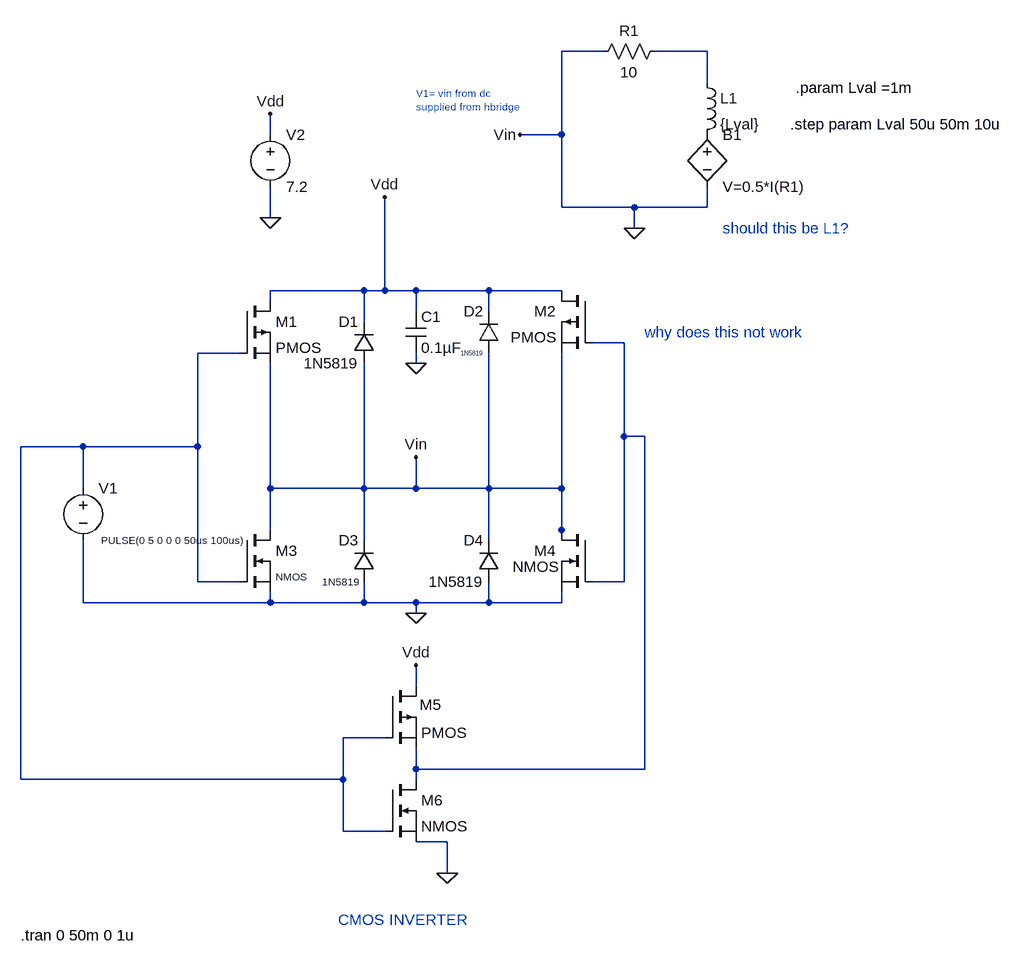
[diagram p0: schematic rl series_SMT WRONG.asc]
rl series_SMT WRONG.asc, the LTspice schematic file:
Version 4.1
SHEET 1 880 1528
WIRE 128 144 64 144
WIRE 288 144 208 144
WIRE 288 192 288 144
WIRE -384 272 -384 240
WIRE 64 272 64 144
WIRE 64 272 0 272
WIRE 64 384 64 272
WIRE 176 384 64 384
WIRE 288 384 288 352
WIRE 288 384 176 384
WIRE -384 400 -384 352
WIRE 176 416 176 384
WIRE -240 512 -384 512
WIRE -208 512 -208 368
WIRE -208 512 -240 512
WIRE -160 512 -208 512
WIRE -48 512 -160 512
WIRE 64 512 -48 512
WIRE -384 528 -384 512
WIRE -160 544 -160 512
WIRE -48 544 -48 512
WIRE -240 560 -240 512
WIRE 160 592 112 592
WIRE -432 608 -496 608
WIRE -160 624 -160 608
WIRE 160 736 160 592
WIRE 192 736 160 736
WIRE -672 752 -768 752
WIRE -496 752 -496 608
WIRE -496 752 -672 752
WIRE -672 816 -672 752
WIRE -384 816 -384 624
WIRE -240 816 -240 624
WIRE -240 816 -384 816
WIRE -160 816 -160 768
WIRE -160 816 -240 816
WIRE -48 816 -48 608
WIRE -48 816 -160 816
WIRE 64 816 64 608
WIRE 64 816 -48 816
WIRE -384 880 -384 816
WIRE 64 880 64 816
WIRE -240 896 -240 816
WIRE -48 896 -48 816
WIRE 64 896 64 880
WIRE -496 960 -496 752
WIRE -432 960 -496 960
WIRE 160 960 160 736
WIRE 160 960 112 960
WIRE -672 992 -672 896
WIRE -384 992 -384 976
WIRE -384 992 -672 992
WIRE -240 992 -240 960
WIRE -240 992 -384 992
WIRE -160 992 -240 992
WIRE -48 992 -48 960
WIRE -48 992 -160 992
WIRE 64 992 64 976
WIRE 64 992 -48 992
WIRE -160 1008 -160 992
WIRE -160 1120 -160 1088
WIRE -208 1200 -272 1200
WIRE -160 1248 -160 1216
WIRE 192 1248 192 736
WIRE 192 1248 -160 1248
WIRE -768 1264 -768 752
WIRE -272 1264 -272 1200
WIRE -272 1264 -768 1264
WIRE -160 1264 -160 1248
WIRE -272 1344 -272 1264
WIRE -208 1344 -272 1344
WIRE -112 1360 -160 1360
WIRE -112 1408 -112 1360
FLAG 176 416 0
FLAG 0 272 Vin
FLAG -208 368 Vdd
FLAG -160 1008 0
FLAG -384 240 Vdd
FLAG -384 400 0
FLAG -160 768 Vin
FLAG -160 1088 Vdd
FLAG -112 1408 0
FLAG -160 624 0
SYMBOL res 224 128 R90
WINDOW 0 0 56 VBottom 2
WINDOW 3 32 56 VTop 2
SYMATTR InstName R1
SYMATTR Value 10
SYMBOL ind 272 176 R0
SYMATTR InstName L1
SYMATTR Value {Lval}
SYMATTR SpiceLine Rser=1m
SYMBOL bv 288 256 R0
SYMATTR InstName B1
SYMATTR Value V=0.5*I(R1)
SYMBOL pmos -432 528 R0
SYMATTR InstName M1
SYMBOL nmos -432 880 R0
WINDOW 3 56 72 Left 1
SYMATTR InstName M3
SYMBOL diode -224 624 R180
WINDOW 0 24 64 Left 2
WINDOW 3 24 0 Left 2
SYMATTR InstName D1
SYMATTR Value 1N5819
SYMATTR Description Diode
SYMATTR Type diode
SYMBOL diode -32 608 R180
WINDOW 0 24 64 Left 2
WINDOW 3 24 0 Left 0
SYMATTR InstName D2
SYMATTR Value 1N5819
SYMATTR Description Diode
SYMATTR Type diode
SYMBOL diode -224 960 R180
WINDOW 0 24 64 Left 2
WINDOW 3 24 0 Left 1
SYMATTR InstName D3
SYMATTR Value 1N5819
SYMATTR Description Diode
SYMATTR Type diode
SYMBOL diode -32 960 R180
WINDOW 0 24 64 Left 2
WINDOW 3 24 0 Left 2
SYMATTR InstName D4
SYMATTR Value 1N5819
SYMATTR Description Diode
SYMATTR Type diode
SYMBOL voltage -672 800 R0
WINDOW 3 242 96 Right 1
WINDOW 123 0 0 Left 0
WINDOW 39 0 0 Left 0
SYMATTR InstName V1
SYMATTR Value PULSE(0 5 0 0 0 50us 100us)
SYMBOL voltage -384 256 R0
WINDOW 123 0 0 Left 0
WINDOW 39 0 0 Left 0
SYMATTR InstName V2
SYMATTR Value 7.2
SYMBOL pmos -208 1120 R0
WINDOW 0 54 29 Left 2
SYMATTR InstName M5
SYMBOL nmos -208 1264 R0
SYMATTR InstName M6
SYMBOL nmos 112 880 M0
WINDOW 3 51 57 Left 2
SYMATTR InstName M4
SYMBOL pmos 112 512 M0
SYMATTR InstName M2
SYMBOL cap -176 544 R0
SYMATTR InstName C1
SYMATTR Value 0.1µF
TEXT 416 256 Left 2 !.step param Lval 50u 50m 10u
TEXT 424 200 Left 2 !.param Lval =1m
TEXT -160 208 Left 1 ;V1= vin from dc\nsupplied from hbridge
TEXT -280 1480 Left 2 ;CMOS INVERTER
TEXT -768 1504 Left 2 !.tran 0 50m 0 1u
TEXT 312 416 Left 2 ;should this be L1?
TEXT 192 576 Left 2 ;why does this not work

The netlist it stands for:
* rl series_SMT WRONG.asc
R1 N001 0 10
L1 N001 P001 {Lval} Rser=1m
B1 P001 0 V=0.5*I(R1)
M1 Vdd N003 0 0 PMOS
M3 0 N003 0 0 NMOS
D1 0 Vdd 1N5819
D2 0 Vdd 1N5819
D3 0 0 1N5819
D4 0 0 1N5819
V1 N003 0 PULSE(0 5 0 0 0 50us 100us)
V2 Vdd 0 7.2
M5 Vdd N003 N002 N002 PMOS
M6 N002 N003 0 0 NMOS
M4 0 N002 0 0 NMOS
M2 Vdd N002 0 0 PMOS
C1 Vdd 0 0.1µF
.model D D
.lib standard.dio
.model NMOS NMOS
.model PMOS PMOS
.lib standard.mos
.step param Lval 50u 50m 10u
.param Lval =1m
* V1= vin from dc
* supplied from hbridge
* CMOS INVERTER
.tran 0 50m 0 1u
* should this be L1?
* why does this not work
.backanno
.end